# EAGLE design Laptimer (EAGLE 6.3)
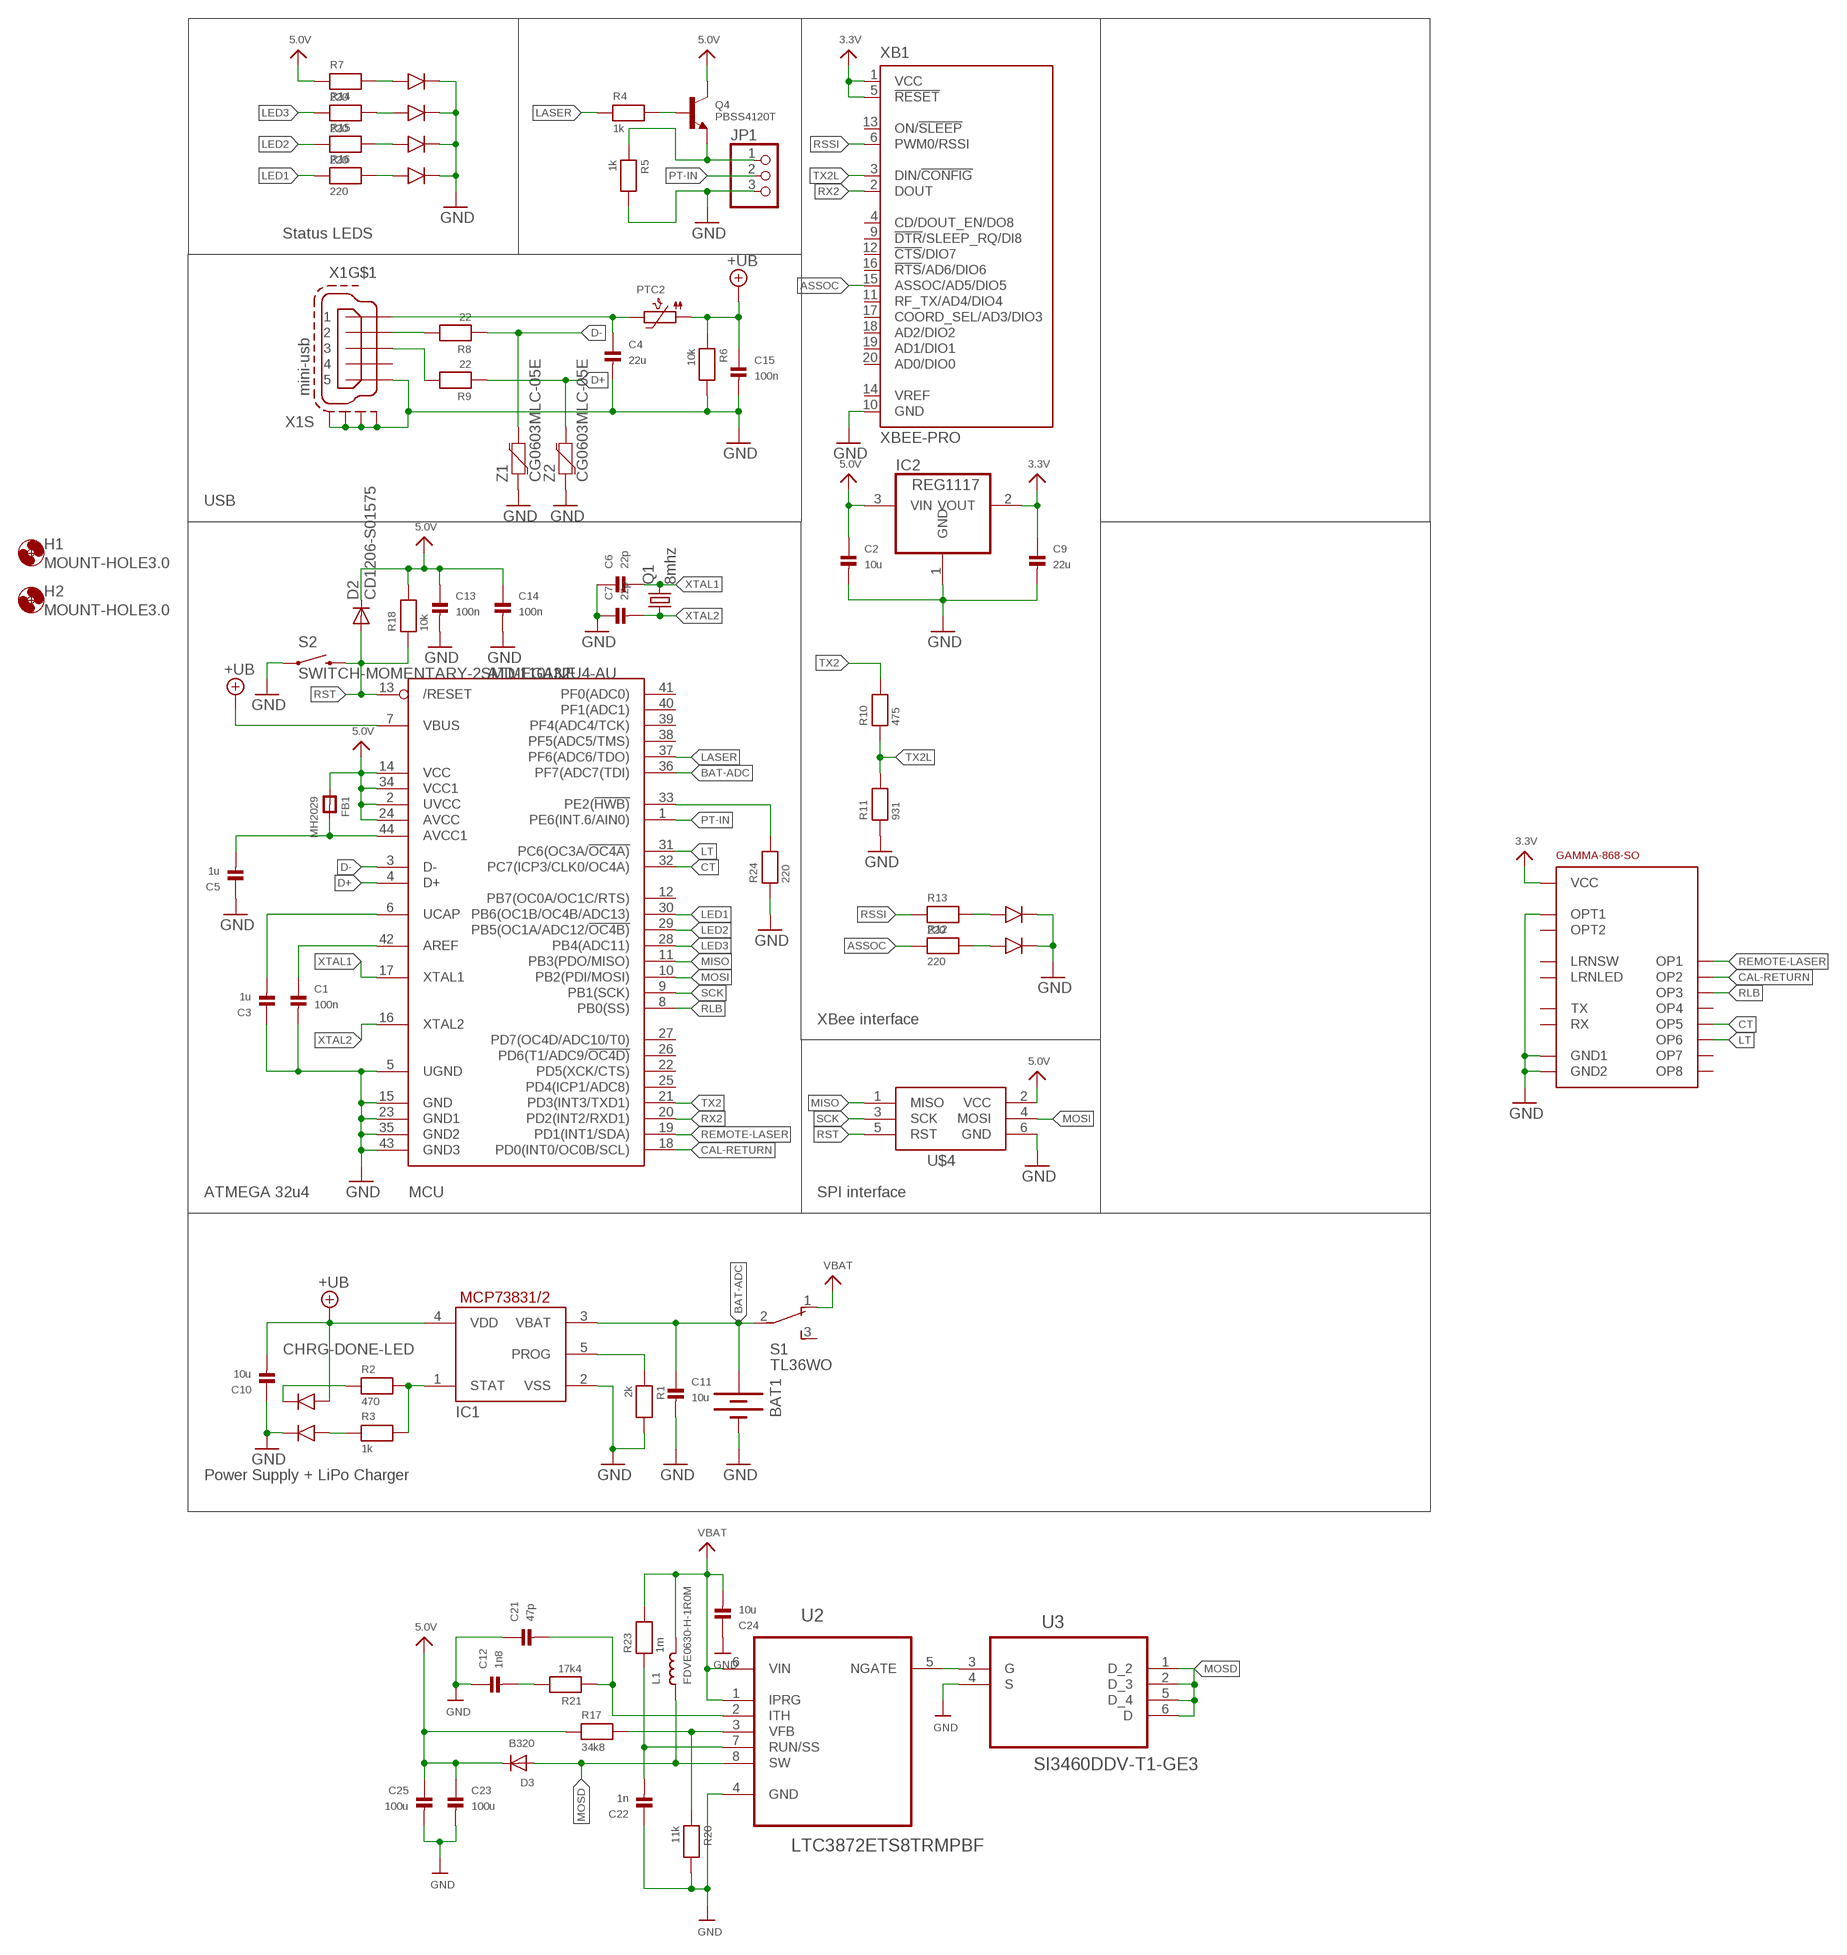
[diagram p0: schematic, sheet 1]

## Parts
BAT1  BATTERY18650  [BATTERY_18650-HOLDER]
C1  100n  CAP_CERAMIC_0603  [_0603]
C2  10u  CAP_CERAMIC_0805  [_0805]
C3  1u  CAP_CERAMIC_0805  [_0805]
C4  22u  CAP_CERAMIC_0805  [_0805]
C5  1u  CAP_CERAMIC_0805  [_0805]
C6  22p  CAP_CERAMIC_0603  [_0603]
C7  22p  CAP_CERAMIC_0603  [_0603]
C9  22u  CAP_CERAMIC_0805  [_0805]
C10  10u  CAP_CERAMIC_0805  [_0805]
C11  10u  CAP_CERAMIC_0805  [_0805]
C12  1n8  CAP_CERAMIC_0603  [_0603]
C13  100n  CAP_CERAMIC_0603  [_0603]
C14  100n  CAP_CERAMIC_0603  [_0603]
C15  100n  CAP_CERAMIC_0603  [_0603]
C21  47p  CAP_CERAMIC_0603  [_0603]
C22  1n  CAP_CERAMIC_0603  [_0603]
C23  100u  CAP_CERAMIC1206  [1206]
C24  10u  CAP_CERAMIC_0805  [_0805]
C25  100u  CAP_CERAMIC1206  [1206]
D2  CD1206-S01575  DIODE-MINIMELF  [MINIMELF]
D3  B320  DIODESMA  [SMADIODE]
FB1  MH2029  FERRITE_0805  [_0805]
H1  MOUNT-HOLE3.0  [3,0]
H2  MOUNT-HOLE3.0  [3,0]
IC1  MCP73831/OT  [SOT23-5L]
IC2  REG1117  [SOT223]
JP1  PINHD-1X3  [1X03]
L1  FDVE0630-H-1R0M  INDUCTORTDK_SLF6045  [INDUCTOR_6X6MM_TDK_SLF6045]
MCU  ATMEGA32U4-AU  [TQFP44]
PTC2  PTC1206  [1206]
Q1  8mhz  CRYSTALHC49S  [HC49/S]
Q4  PBSS4120T  TRANSISTOR_NPNWIDE  [SOT23-WIDE]
R1  2k  RESISTOR_0603  [_0603]
R2  470  RESISTOR_0603  [_0603]
R3  1k  RESISTOR_0603  [_0603]
R4  1k  RESISTOR_0603  [_0603]
R5  1k  RESISTOR_0603  [_0603]
R6  10k  RESISTOR_0603  [_0603]
R7  220  RESISTOR_0603  [_0603]
R8  22  RESISTOR_0603  [_0603]
R9  22  RESISTOR_0603  [_0603]
R10  475  RESISTOR_0603  [_0603]
R11  931  RESISTOR_0603  [_0603]
R12  220  RESISTOR_0603  [_0603]
R13  220  RESISTOR_0603  [_0603]
R14  220  RESISTOR_0603  [_0603]
R15  220  RESISTOR_0603  [_0603]
R16  220  RESISTOR_0603  [_0603]
R17  34k8  RESISTOR_0603  [_0603]
R18  10k  RESISTOR_0603  [_0603]
R20  11k  RESISTOR_0603  [_0603]
R21  17k4  RESISTOR_0603  [_0603]
R23  1m  RESISTOR_0603  [_0603]
R24  220  RESISTOR_0603  [_0603]
S1  TL36WO  [TL3XWO]
S2  SWITCH-MOMENTARY-2SMD-1101NE  [TACTILE-SWITCH-1101NE]
U2  LTC3872ETS8TRMPBF  [SOT65P280X100-8N]
U3  SI3460DDV-T1-GE3  SI3457CDV-T1-GE3  [SOT95P285X110-6N]
U$4  AVRISP-BOX  [AVRISP-BOX]
U$7  GAMMA-868-SO  [UNICORN_V2_GAMMA-868-SO]
U$11  BI-LEVEL-LED-INDICATOR  [BI-LEVEL-LED-INDICATOR]
U$13  BI-LEVEL-LED-INDICATOR  [BI-LEVEL-LED-INDICATOR]
U$14  BI-LEVEL-LED-INDICATOR  [BI-LEVEL-LED-INDICATOR]
U$17  BI-LEVEL-LED-INDICATOR  [BI-LEVEL-LED-INDICATOR]
X1  mini-usb  MINI-USB-SCHIELD-32005-301  [32005-301]
XB1  XBEE-PRO  [XBEE-PRO]
Z1  CG0603MLC-05E  VARISTOR-0603  [0603-RES]
Z2  CG0603MLC-05E  VARISTOR-0603  [0603-RES]

## Nets
1D+: R9.2 X1.3
1D-: R8.2 X1.2
3.3V: C9.1 IC2.2(VOUT) U$7.P$16(VCC) XB1.1(VCC) XB1.5(!RESET)
5.0V: C2.1 C13.1 C14.1 C23.1 C25.1 D2.C D3.C FB1.1 IC2.3(VIN) MCU.2(UVCC) MCU.14(VCC) MCU.24(AVCC) MCU.34(VCC1) Q4.3(C) R7.1 R17.1 R18.2 U$4.2(VCC)
+UB: C10.2 C15.1 IC1.4(VDD) MCU.7(VBUS) PTC2.1 R6.1 U$13.ANODE1
ASSOC: R12.1 XB1.15(ASSOC/AD5/DIO5)
BAT-ADC: BAT1.PWR@1(+) C11.1 IC1.3(VBAT) MCU.36(PF7(ADC7(TDI)) S1.2(P)
CAL-RETURN: MCU.18(PD0(INT0/OC0B/SCL)) U$7.P$4(OP2)
CHRG-DONE-LED: R3.1 U$13.ANODE2
CT: MCU.32(PC7(ICP3/CLK0/OC4A)) U$7.P$9(OP5)
D+: MCU.4(D+) R9.1 Z2.2
D-: MCU.3(D-) R8.1 Z1.2
GND: BAT1.GND@1(-) C1.2 C2.2 C3.1 C4.2 C5.1 C6.1 C7.1 C9.2 C10.1 C11.2 C12.1 C13.2 C14.2 C15.2 C21.1 C22.1 C23.2 C24.1 C25.2 IC1.2(VSS) IC2.1(GND) JP1.3 MCU.5(UGND) MCU.15(GND) MCU.23(GND1) MCU.35(GND2) MCU.43(GND3) R1.2 R5.2 R6.2 R11.1 R20.2 R24.1 S2.1 U2.4(GND) U3.4(S) U$4.6(GND) U$7.P$2(GND1) U$7.P$10(OPT1) U$7.P$15(GND2) U$11.CATHODE1 U$11.CATHODE2 U$13.CATHODE2 U$14.CATHODE1 U$14.CATHODE2 U$17.CATHODE1 U$17.CATHODE2 X1.5 X1.M1(S:S1) X1.M2(S:S2) X1.M3(S:S3) X1.M4(S:S4) XB1.10(GND) Z1.1 Z2.1
LASER: MCU.37(PF6(ADC6/TDO)) R4.1
LED1: MCU.30(PB6(OC1B/OC4B/ADC13)) R16.1
LED2: MCU.29(PB5(OC1A/ADC12/!OC4B)) R15.1
LED3: MCU.28(PB4(ADC11)) R14.1
LT: MCU.31(PC6(OC3A/!OC4A)) U$7.P$11(OP6)
MISO: MCU.11(PB3(PDO/MISO)) U$4.1(MISO)
MOSD: D3.A L1.P$1 U2.8(SW) U3.1(D_2) U3.2(D_3) U3.5(D_4) U3.6(D)
MOSI: MCU.10(PB2(PDI/MOSI)) U$4.4(MOSI)
N$1: R17.2 R20.1 U2.3(VFB)
N$2: C12.2 R21.2
N$3: IC1.5(PROG) R1.1
N$4: IC1.1(STAT) R2.2 R3.2
N$5: JP1.1 Q4.2(E) R5.1
N$6: Q4.1(B) R4.2
N$7: C5.2 FB1.2 MCU.44(AVCC1)
N$8: U2.5(NGATE) U3.3(G)
N$9: C1.1 MCU.42(AREF)
N$10: MCU.33(PE2(!HWB)) R24.2
N$12: C3.2 MCU.6(UCAP)
N$13: C4.1 PTC2.2 X1.1
N$14: R2.1 U$13.CATHODE1
N$15: R16.2 U$17.ANODE1
N$17: R12.2 U$11.ANODE1
N$19: R13.2 U$11.ANODE2
N$21: R15.2 U$17.ANODE2
N$25: R14.2 U$14.ANODE1
N$27: C21.2 R21.1 U2.2(ITH)
N$29: C22.2 R23.1 U2.7(RUN/SS)
N$32: R7.2 U$14.ANODE2
PT-IN: JP1.2 MCU.1(PE6(INT.6/AIN0))
REMOTE-LASER: MCU.19(PD1(INT1/SDA)) U$7.P$3(OP1)
RLB: MCU.8(PB0(SS)) U$7.P$7(OP3)
RSSI: R13.1 XB1.6(PWM0/RSSI)
RST: D2.A MCU.13(/RESET) R18.1 S2.2 U$4.5(RST)
RX2: MCU.20(PD2(INT2/RXD1)) XB1.2(DOUT)
SCK: MCU.9(PB1(SCK)) U$4.3(SCK)
TX2: MCU.21(PD3(INT3/TXD1)) R10.2
TX2L: R10.1 R11.2 XB1.3(DIN/!CONFIG)
VBAT: C24.2 L1.P$2 R23.2 S1.1(O) U2.1(IPRG) U2.6(VIN)
XTAL1: C6.2 MCU.17(XTAL1) Q1.2
XTAL2: C7.2 MCU.16(XTAL2) Q1.1
Unconnected: MCU.12(PB7(OC0A/OC1C/RTS)) MCU.22(PD5(XCK/CTS)) MCU.25(PD4(ICP1/ADC8)) MCU.26(PD6(T1/ADC9/!OC4D)) MCU.27(PD7(OC4D/ADC10/T0)) MCU.38(PF5(ADC5/TMS)) MCU.39(PF4(ADC4/TCK)) MCU.40(PF1(ADC1)) MCU.41(PF0(ADC0)) S1.3(S) U$7.P$5(LRNSW) U$7.P$6(LRNLED) U$7.P$8(OP4) U$7.P$12(OP7) U$7.P$13(OP8) U$7.P$14(OPT2) U$7.P$17(TX) U$7.P$18(RX) X1.4 XB1.4(CD/DOUT_EN/DO8) XB1.9(!DTR!/SLEEP_RQ/DI8) XB1.11(RF_TX/AD4/DIO4) XB1.12(!CTS!/DIO7) XB1.13(ON/!SLEEP) XB1.14(VREF) XB1.16(!RTS!/AD6/DIO6) XB1.17(COORD_SEL/AD3/DIO3) XB1.18(AD2/DIO2) XB1.19(AD1/DIO1) XB1.20(AD0/DIO0)

## Notes on the sheet
- Status LEDS
- USB
- XBee interface
- ATMEGA 32u4 | SPI interface
- Power Supply + LiPo Charger

## Library data of the parts
BAT1 = SparkFun-Electromechanical:BATTERY: Battery Holders Various common sizes : AA, AAA, 18650 (PRT-12895), 20mm coin cell and 12mm coin cell. 20MM_4LEGS, BATT-10373
C1-C7 C9-C15 C21-C25 = microbuilder:CAP_CERAMIC: Ceramic Capacitors 0402 - 0402 Surface Mount Capacitors 16pF 50V 5% [Digikey: 445-4899-2-ND] 18pF 50V 5% [Digikey: 490-1281-2-ND] 22pF 50V 5% [Digikey: 490-1283-2-ND] 68pF 50V 5% [Digikey: 490-1289-2-ND] 0.1uF 10V 10% [Digikey: 490-1318-2-ND] 1.0uF 6.3V 10% [Digikey: 490-1320-2-ND] 0603 - 0603 Surface Mount Capacitors 16 pF 50V 5% [Digikey: 445-5051-2-ND] 22 pF 50V [Digikey: PCC220ACVTR-ND] 33 pF 50V 5% [Digikey: 490-1415-1-ND] 56pF 50V 5% [Digikey: 490-1421-1-ND] 220pF 50V 5% [Digikey: 445-1285-1-ND] 680 pF 50V 2200 pF 50V 5% C0G [Digikey: 445-1297-1-ND] 5600 pF 100V 5% X7R [Digikey: 478-3711-1-ND] 0.1 µF 25V 10% [Digikey: PCC2277TR-ND] 0.22 µF 16V 10% X7R [Digikey: 445-1318-1-ND] 1.0 µF 25V 10% [Digikey: 445-5146-2-ND] 0603 - RF Specific 3pF 250V +/-0.1pF RF [Digikey: 712-1347-1-ND] 18 pF 250V 5% [Digikey: 478-3505-1-ND or 712-1322-1-ND] 56 pF 250V 5% C0G RF [Digikey: 490-4867-1-ND] 68 pF 250V RF [Digikey: 490-4868-1-ND] 0805 - 0805 Surface Mount Capacitors 220 pF 250V 2% RF Ceramic Capacitor [Digikey: 712-1398-1-ND] 1000 pF 50V 2% NP0 Ceramic Capacitor [Digikey: 478-3760-1-ND] 0.1 µF 25V 10% Ceramic Capacitor [Digikey: PCC1828TR-ND] 1.0 µF 16V 10% Ceramic Capacitor[Digikey: 490-1691-2-ND] 10.0 µF 10V 10% Ceramic Capacitor[Digikey: 709-1228-1-ND] 10.0 uF 16V 10% Ceramic Capacitor [Digikey: 478-5165-2-ND] 47 uF 6.3V 20% Ceramic Capacitor [Digikey: 587-1779-1-ND or 399-5506-1-ND] 1206 - 1206 Surface Mount Capacitors 47uF 10V 20% Ceramic Capacitor [Digikey: 490-5528-1-ND or 399-5508-1-ND or 445-6010-1-ND] 100uF 6.3V -20%, +80% Y5V Ceramic Capacitor (Digikey: 490-4512-1-ND, Mouser: 81-GRM31CF50J107ZE1L)
D2 = diode:DIODE-: DIODE
D3 = adafruit:DIODE: Diode SMADIODE - SMA Surface Mount Package 20V 1A Schottky Diode Digikey: 641-1014-6-ND DO-1N4148 - Through Hole Small Current Diode SOD-123 20V 1 A (.5mV Vf) Schottky Diode - Digikey: MBRX120TPMSCT-ND SOD-323 10V 570mA (.38mV Vf, 3ns) Schottky Diode - Digikey: ZLLS410CT-ND SOD-523 30V 30mA Schottky Diode (RB751S-40TE61) - Digikey: RB751S-40TE61CT-ND SOT23-R/W - SOT23 Package (R = Solder Paste/Reflow Ovens, W = Hand-Soldering) BAT54Film 40V 300mA - Digikey: 497-7162-1-ND
FB1 = microbuilder:FERRITE: Ferrite Bead 0603 MMZ1608B121C - 120 Ohm @ 100MHz, 600mA, 0.15 Ohm DC Resistance - Digikey: 445-2164-1-ND BK1608HW121-T - 120 Ohm, 600mA Ferrite Chip - Digikey: 587-1876-2-ND 0805 HZ0805B272R-10 - 2.7K Ohm @ 100MHz, 200mA, 0.8 Ohm DC Resistance - Digikey: 240-2504-1-ND (see also Murata BLM21BD272SN1L) MMZ2012Y152B - 1.5K Ohm @ 100MHz, 500mA, 0.4 Ohm DC Resistance - Digikey: 445-1560-1-ND - Mainly for high frequency (80-400MHz) MMZ2012R102A - 1K Ohm @ 100MHz, 500mA, 0.3 Ohm DC Resistance - Digikey: 445-1555-2-ND - More general purpose (10-200MHz)
H1 H2 = holes:MOUNT-HOLE: MOUNTING HOLE with drill center marker
IC1 = adafruit:MCP73831: MCP73831/2 Miniature Single-Cell, Fully Integrated Li-Ion, Li-Polymer Charge Management Controllers. Nice and small simple lipoly charge controller, with adjustable current and status output (LED) http://www.ladyada.net/library/pcb/eaglelibrary.html
IC2 = burr-brown:REG1117: 800mA and 1A Low Dropout (LDO) Positive Regulator 1.8V, 2.5V, 2.85V, 3.3V, 5V, and Adj; MPN: REG1117; OC_FARNELL: 1097566; OC_NEWARK: 14P6981
JP1 = adafruit:PINHD-1X3: PIN HEADER
L1 = microbuilder:INDUCTOR: Inductors 0603: 10nH Ceramic Inductor - microwire antenna/RF (Digikey: 712-1434-2-ND) 0805: 560nH Ceramic Inductor - RF (Digikey: 553-1047-1-ND) 270nH Ceramic Inductor - Q = 40@250MHz, +-5%, 1 Ohm DC Resistance (Digikey: 535-10506-2-ND) 1007 (2518 Metric) SMT: 10µH 10% 250mOhm 820mA 1007 Inductor (Digikey: 587-2189-1-ND) 22µH 10% 500mOhm 580mA 1007 Inductor (Digikey: 587-2190-1-ND) 47µH 10% 950mOhm 420mA 1007 Inductor (Digikey: 587-2191-1-ND) 47µH 5% 100mOhm 1A 1008 Inductor (Digikey: 732-1816-1-ND) 5.0x5.0mm (Taiyo Yuden NR5040 Series) 6.8µH 20% 2.3A 64mOhm Inductor (Digikey: 587-2374-2-ND) 5.0x5.0mm (TDK VLC5045 Series) 4.7µH 20% 3.3A 34mOhm Inductor (Digikey: 445-6526-1-ND) 6.8µH 20% 2.7A 46mOhm Inductor (Digikey: 445-6527-1-ND) 6.0x6.0mm (TDK VLC6045 Series) 4.7µH 20% 3.8A 27mOhm Inductor (Digikey: 445-6538-2-ND) 6.8µH 20% 3A 41mOhm Inductor (Digikey: 445-6540-1-ND) 6.2µH 30% 2.2A 45mOhm Inductor (Digikey: SRR5028-6R2YCT-ND) - Not TDK VLC6045 but footprint should match 6.0x6.0mm (TDK SLF6045 Series) 6.8uH 30% 2A 33mOhm Inductor (Digikey: 445-4572-1-ND, Mouser: 810-SLF645T6R8N2R0PF)
MCU = adafruit:ATMEGA32U4: http://www.ladyada.net/library/eagle
PTC2 = microbuilder:PTC: PTC (Resettable Fuse) 1206 Package 250mA PTC (16V Max, Time-to-Trip: 0.08s) - Digikey: F2110CT-ND 1210 Package 100mA PTC (30V Max, Time-to-Trip: 0.6s) - Digikey: MF-USMF010-2CT-ND 1812 Package 750mA PTC (24V Max, Time-to-Trip: 0.2s) - Digikey: MF-MSMF075/24-2CT-ND
Q1 = adafruit:CRYSTAL: CRYSTAL; OC_FARNELL: 1667008; OC_NEWARK: unknown
Q4 = microbuilder:TRANSISTOR_NPN: NPN Transistor Transistor (NPN) 500mA 45V - BC817 [Digikey: 568-1631-1-ND] Transistor (NPN) 500mA 45V - BC817,215 [Mouser: 771-BC817-T/R] SOT23-R - SOT23 footprint optimised for use with solder paste and reflow ovens. SOT23-W - SOT23 footprint optimised for hand-soldering (larger pads).
R1-R18 R20 R21 R23 R24 = microbuilder:RESISTOR: Resistors 0402 - 0402 Surface Mount Package 22 Ohm 1% 1/16W [Digikey: 311-22.0LRTR-ND] 33 Ohm 5% 1/16W 1.0K 5% 1/16W 1.5K 5% 1/16W 2.0K 1% 1/16W 10.0K 1% 1/16W [Digikey: 311-10.0KLRTR-ND] 10.0K 5% 1/16W [Digikey: RMCF0402JT10K0TR-ND] 12.1K 1% 1/16W [Digikey: 311-22.0LRTR-ND] 100.0K 5% 1/16W 0603 - 0603 Surface Mount Package 0 Ohm 1/10 Watt 1% Resistor 15 Ohm 1/10 Watt 1% Resistor 33 Ohm 1/10 Watt 1% Resistor 49.9 Ohm 1/10 Watt 1% Resistor 100 Ohm 1/10 Watt 1% Resistor 150 Ohm 1/10 Watt 1% Resistor 240 Ohm 1/10 Watt 1% Resistor 390 Ohm 1/10 Watt 1% Resistor 560 Ohm 1/10 Watt 1% Resistor 680 Ohm 1/10 Watt 1% Resistor 750 Ohm 1/10 Watt 1% Resistor 1.0K Ohm 1/10 Watt 1% Resistor 1.5K Ohm 1/10 Watt 1% Resistor 2.0K Ohm 1/10 Watt 1% Resistor 2.2K Ohm 1/10 Watt 1% Resistor 3.3K Ohm 1/10 Watt 1% Resistor 4.7K Ohm 1/10 Watt 1% Resistor 10.0K Ohm 1/10 Watt 1% Resistor 12.0K Ohm 1/10 Watt 1% Resistor 12.1K Ohm 1/10 Watt 1% Resistor 20.0K Ohm 1/10 Watt 1% Resistor 33.0K Ohm 1/10 Watt 1% Resistor 100.0K Ohm 1/10 Watt 1% Resistor 0805 - 0805 Surface Mount Package 0 Ohm 1/8 Watt 1% Resistor 33 Ohm 1/8 Watt 1% Resistor 100 Ohm 1/8 Watt 1% Resistor 150 Ohm 1/8 Watt 1% Resistor 200 Ohm 1/8 Watt 1% Resistor 240 Ohm 1/8 Watt 1% Resistor 330 Ohm 1/8 Watt 1% Resistor 390 Ohm 1/8 Watt 1% Resistor 470 Ohm 1/8 Watt 1% Resistor 1.0K Ohm 1/8 Watt 1% Resistor 1.5K Ohm 1/8 Watt 1% Resistor 2.0K Ohm 1/8 Watt 1% Resistor 4.7K Ohm 1/8 Watt 1% Resistor 5.1K Ohm 1/8 Watt 1% Resistor 5.6K Ohm 1/8 Watt 1% Resistor 10.0K Ohm 1/8 Watt 1% Resistor 22.0K Ohm 1/8 Watt 1% Resistor 33.0K Ohm 1/8 Watt 1% Resistor 100K Ohm 1/8 Watt 1% Resistor 1206 - 1206 Surface Mount Package 2012 - 2010 Surface Mount Package 0.11 Ohm 1/2 Watt 1% Resistor - Digikey: RHM.11UCT-ND
S1 = switch:TL36WO: TINY SWITCH ON - ON Source: http://www2.produktinfo.conrad.com/datenblaetter/700000-724999/705152-da-01-de-Subminiaturschalter_TL_36WO.pdf
S2 = SparkFun-Electromechanical:SWITCH-MOMENTARY-2: Various NO switches- pushbuttons, reed, etc; PROD_ID: SWCH-00815
U2 = LTC_By_element14_Batch_1:LTC3872ETS8TRMPBF: DC/DC Controller; MPN: LTC3872ETS8#TRMPBF; OC_FARNELL: 1556409; OC_NEWARK: 56M8617; PACKAGE: SOT-23-8; SUPPLIER: LINEAR TECHNOLOGY
U3 = Vishay_By_element14_Batch_1:SI3457CDV-T1-GE3: N-Channel 30-V (D-S) MOSFET; MPN: SI3457CDV-T1-GE3; OC_FARNELL: 1840420; OC_NEWARK: 90R9127; PACKAGE: TSOP-6; SUPPLIER: Vishay Siliconix
U$4 = adafruit:AVRISP: AVR ISP HEADER Standard 6 pin header for AVR programming
U$7 = unicorn_v2:GAMMA-868-SO
U$11 U$13 U$14 U$17 = unicorn_v2:BI-LEVEL-LED-INDICATOR
X1 = con-cypressindustries:MINI-USB-SCHIELD-: MINI USB-B Conector Source: www.cypressindustries.com; OC_FARNELL: unknown; OC_NEWARK: unknown
XB1 = microbuilder:XBEE: XBee (TM) /XBee-PRO(TM) OEM RF Modules Source: MaxStream, Inc. xbee_productmanual.pdf
Z1 Z2 = SparkFun-DiscreteSemi:VARISTOR: Varistor Varistor (Variable resistor) is a nonlinear resistive element of the voltage dependence that resistance changes with applied voltage. Varistor is equivalent with Zener diode of two series connection.

## Board
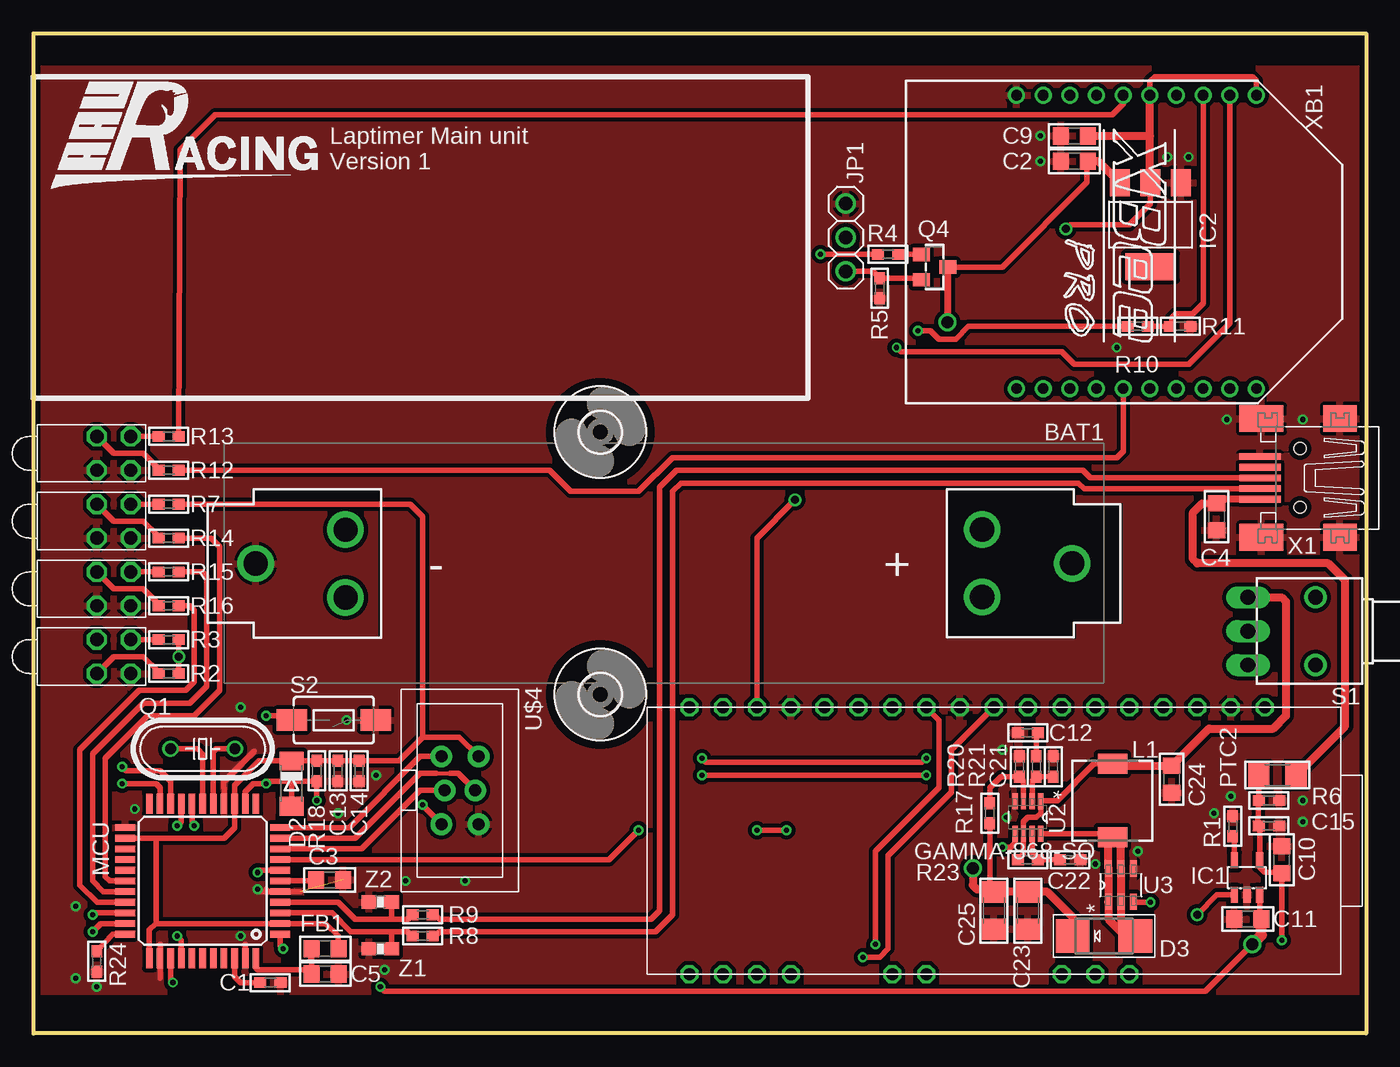
[diagram p1: board, top side]
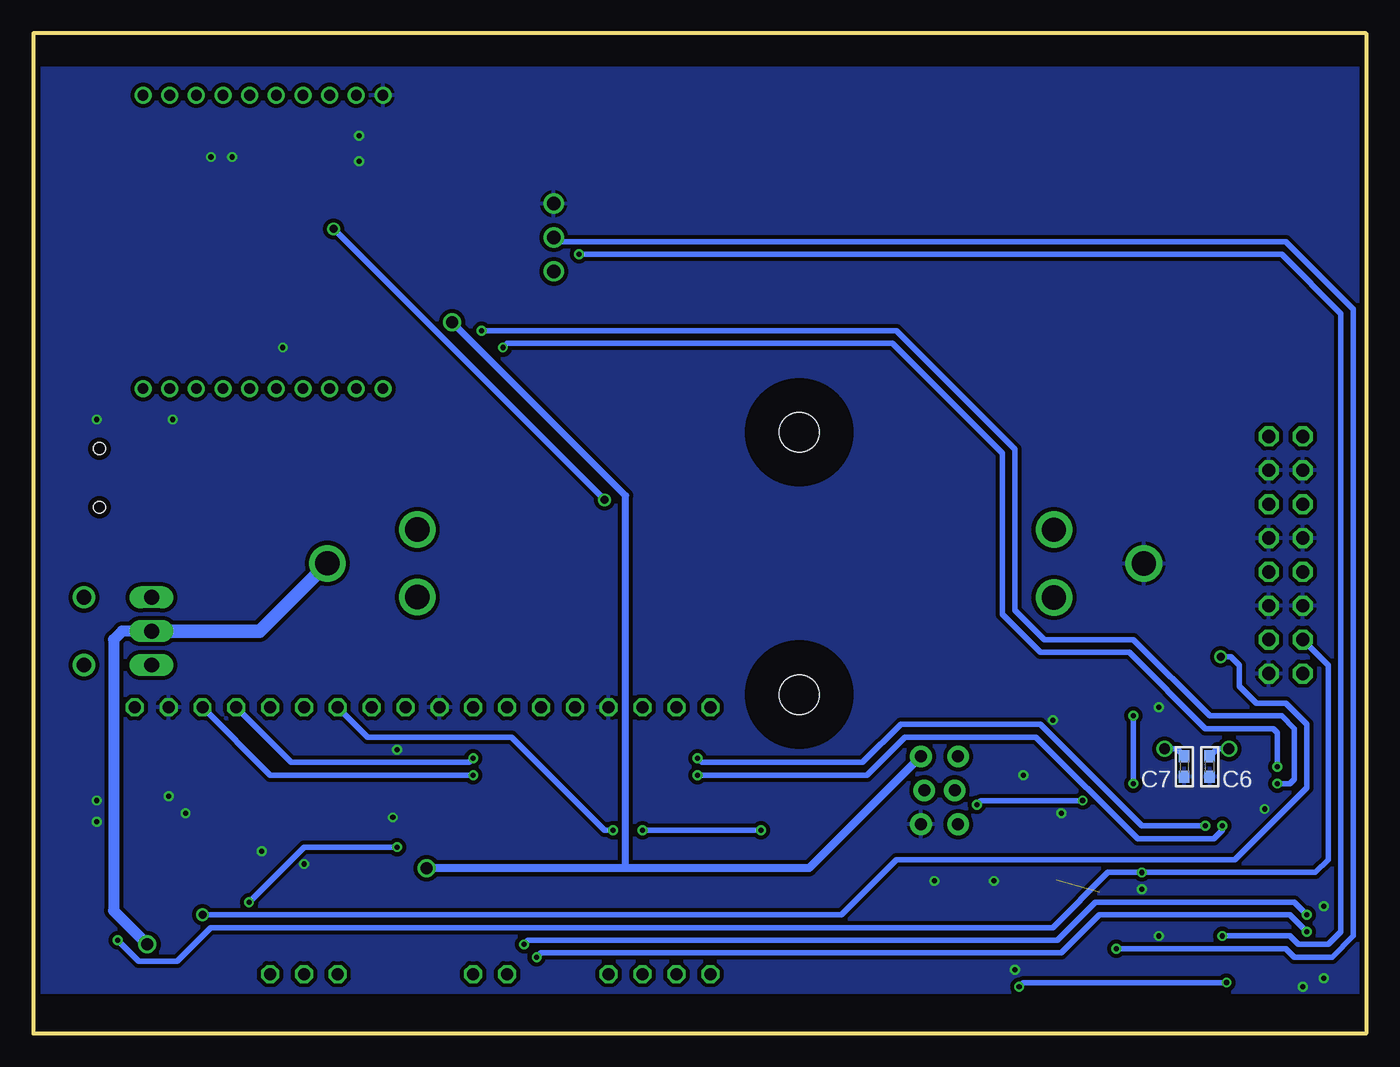
[diagram p2: board, bottom side, seen from below]

Size 100 x 75 mm. Coordinates in mm from the lower left corner, seen from the top.
Outline: 0,75 100,75 100,0 0,0 0,75
Copper layers (1*16): Top 0.0356mm / dielectric 1.5011mm / Bottom 0.0356mm
Design rules "LaenPCBOrder *": minimum track width 6mil, minimum drill 13mil, track to track 12mil, track to pad 12mil, pad to pad 12mil, via to via 12mil, smd to smd 12mil, copper to edge 15mil, drill to drill 6mil, minimum pad ring 7mil, minimum via ring 7mil, stop-mask expansion 3mil, vias tented up to drill 0mil, thermal gap 10mil

### Footprints (pad centres in the part's own frame; a part is rotated, then mirrored left to right if it is on the bottom)
BATTERY_18650-HOLDER = drill 1.829: GND@1 30.628,0.01; GND@2 23.88,2.55; GND@3 23.88,-2.53; PWR@1 -30.628,-0.01; PWR@2 -23.88,2.53; PWR@3 -23.88,-2.55
_0603 = smd 0.9 x 0.8: 1 -0.762,0; 2 0.762,0
_0805 = smd 1.2 x 1.3: 1 -1.016,0; 2 1.016,0
1206 = smd 1.6 x 1.8: 1 -1.4,0; 2 1.4,0
MINIMELF = smd 1.4 x 1.8: A 1.7,0; C -1.7,0
SMADIODE = smd 2.54 x 2.54: A 2.349,0; C -2.349,0
3,0 = hole 3: 0,0
SOT23-5L = smd 0.55 x 1.2: 1 -0.95,-1.3; 2 0,-1.3; 3 0.95,-1.3; 4 0.95,1.3; 5 -0.95,1.3
SOT223 = smd 1.499 x 2.007: 1 -2.261,-3.15; 2 0.025,-3.15; 3 2.311,-3.15 | smd 3.81 x 2.007: 4 0,3.15
1X03 = drill 1.016: 1 -2.54,0; 2 0,0; 3 2.54,0
INDUCTOR_6X6MM_TDK_SLF6045 = smd 1.5 x 2.2: P$1 -2.75,0; P$2 2.75,0
TQFP44 = smd 1.5 x 0.5: 1 -5.8,4; 2 -5.8,3.2; 3 -5.8,2.4; 4 -5.8,1.6; 5 -5.8,0.8; 6 -5.8,0; 7 -5.8,-0.8; 8 -5.8,-1.6; 9 -5.8,-2.4; 10 -5.8,-3.2; 11 -5.8,-4; 23 5.8,-4; 24 5.8,-3.2; 25 5.8,-2.4; 26 5.8,-1.6; 27 5.8,-0.8; 28 5.8,0; 29 5.8,0.8; 30 5.8,1.6; 31 5.8,2.4; 32 5.8,3.2; 33 5.8,4 | smd 0.5 x 1.5: 12 -4,-5.8; 13 -3.2,-5.8; 14 -2.4,-5.8; 15 -1.6,-5.8; 16 -0.8,-5.8; 17 0,-5.8; 18 0.8,-5.8; 19 1.6,-5.8; 20 2.4,-5.8; 21 3.2,-5.8; 22 4,-5.8; 34 4,5.8; 35 3.2,5.8; 36 2.4,5.8; 37 1.6,5.8; 38 0.8,5.8; 39 0,5.8; 40 -0.8,5.8; 41 -1.6,5.8; 42 -2.4,5.8; 43 -3.2,5.8; 44 -4,5.8
HC49/S = drill 0.813: 1 -2.413,0; 2 2.413,0
SOT23-WIDE = smd 1 x 1.27: 1 -0.95,-1; 2 0.95,-1; 3 0,1
TL3XWO = drill 1.1 pad 1.422 long: 1 -2.54,-5.08; 2 0,-5.08; 3 2.54,-5.08 | drill 1.1 pad 1.676: M1 -2.54,0; M2 2.54,0
TACTILE-SWITCH-1101NE = smd 2.3 x 1.6: 1 -3.15,0; 2 3.15,0
SOT65P280X100-8N = smd 1.219 x 0.406: 1 -1.219,0.965; 2 -1.219,0.33; 3 -1.219,-0.33; 4 -1.219,-0.965; 5 1.219,-0.965; 6 1.219,-0.33; 7 1.219,0.33; 8 1.219,0.965
SOT95P285X110-6N = smd 1.219 x 0.508: 1 -1.245,0.94; 2 -1.245,0; 3 -1.245,-0.94; 4 1.245,-0.94; 5 1.245,0; 6 1.245,0.94
AVRISP-BOX = drill 0.9 pad 1.626: 1 -1.397,2.54; 2 1.397,2.54; 3 -1.143,0; 4 1.143,0; 5 -1.397,-2.54; 6 1.397,-2.54
UNICORN_V2_GAMMA-868-SO = drill 0.9 octagon: P$1 0,0; P$2 2.54,0; P$3 5.08,0; P$4 7.62,0; P$5 10.16,0; P$6 12.7,0; P$7 15.24,0; P$8 17.78,0; P$9 20.32,0; P$10 22.86,0; P$11 25.4,0; P$12 27.94,0; P$13 30.48,0; P$14 33.02,0; P$15 35.56,0; P$16 38.1,0; P$17 40.64,0; P$18 43.18,0; P$19 43.18,20.003; P$20 40.64,20.003; P$21 38.1,20.003; P$22 35.56,20.003; P$23 27.94,20.003; P$24 25.4,20.003; P$25 15.24,20.003; P$26 12.7,20.003; P$27 10.16,20.003
BI-LEVEL-LED-INDICATOR = drill 1 octagon: ANODE1 1.27,1.27; ANODE2 1.27,-1.27; CATHODE1 -1.27,1.27; CATHODE2 -1.27,-1.27
32005-301 = smd 3.1 x 0.5: 1 3,1.6; 2 3,0.8; 3 3,0; 4 3,-0.8; 5 3,-1.6 | smd 2.5 x 2: M1 -3,-4.45; M2 -3,4.45 | smd 3.3 x 2: M3 2.9,4.45; M4 2.9,-4.45 | hole 0.9: 0,2.2; 0,-2.2
XBEE-PRO = drill 0.8 pad 1.27: 1 -11,9; 2 -11,7; 3 -11,5; 4 -11,3; 5 -11,1; 6 -11,-1; 7 -11,-3; 8 -11,-5; 9 -11,-7; 10 -11,-9; 11 11,-9; 12 11,-7; 13 11,-5; 14 11,-3; 15 11,-1; 16 11,1; 17 11,3; 18 11,5; 19 11,7; 20 11,9
0603-RES = smd 1.1 x 1: 1 -0.85,0; 2 0.85,0

### Placement (x,y rotation side)
BAT1  47.31,35.24 180 top
C1  17.78,3.81 0 top
C2  78.11,65.41 180 top
C3  22.23,11.51 180 top
C4  88.77,38.73 270 top
C5  21.91,4.45 180 top
C6  11.75,20 90 bottom
C7  13.65,20 90 bottom
C9  78.11,67.31 180 top
C10  93.66,13.02 270 top
C11  91.12,8.57 180 top
C12  74.61,22.54 0 top
C13  22.86,19.68 270 top
C14  24.45,19.68 270 top
C15  92.71,15.56 0 top
C21  76.52,20 270 top
C22  77.79,13.02 180 top
C23  74.61,9.21 270 top
C24  85.41,19.05 90 top
C25  72.07,9.21 270 top
D2  19.37,18.73 270 top
D3  80.33,7.3 0 top
FB1  21.91,6.35 180 top
H1  42.55,45.09 0 top
H2  42.55,25.4 0 top
IC1  91.06,11.68 0 top
IC2  83.82,60.64 180 top
JP1  60.96,59.69 90 top
L1  80.96,17.46 90 top
MCU  12.71,11.43 180 top
PTC2  93.34,19.37 0 top
Q1  12.71,21.34 180 top
Q4  67.63,57.47 270 top
R1  89.99,15.53 90 top
R2  10.16,26.99 0 top
R3  10.16,29.53 0 top
R4  64.14,58.42 0 top
R5  63.5,55.88 270 top
R6  92.71,17.46 0 top
R7  10.16,39.69 180 top
R8  29.21,7.3 0 top
R9  29.21,8.89 0 top
R10  82.87,53.02 180 top
R11  86.04,53.02 180 top
R12  10.16,42.23 180 top
R13  10.16,44.77 180 top
R14  10.16,37.15 180 top
R15  10.16,34.61 180 top
R16  10.16,32.07 180 top
R17  71.75,16.51 90 top
R18  21.27,19.68 90 top
R20  73.98,20 90 top
R21  75.25,20 90 top
R23  74.61,13.02 180 top
R24  4.76,5.4 90 top
S1  96.2,30.16 270 top
S2  22.54,23.5 180 top
U2  74.61,16.19 270 top
U3  81.6,11.11 90 top
U$4  32.01,18.22 0 top
U$7  92.39,24.45 180 top
U$11  6.03,43.5 90 top
U$13  6.03,28.26 90 top
U$14  6.03,38.42 90 top
U$17  6.03,33.34 90 top
X1  95.03,41.66 180 top
XB1  82.77,59.35 270 top
Z1  26.04,6.35 0 top
Z2  26.04,9.84 0 top

### Tracks (layer width: path | path; a pad name or v marks a point on that pad's centre or on a via)
1D+
  Top 0.406: R9.2 30.16,8.89 30.48,8.57 46.35,8.57 46.99,9.21 46.99,40.96 48.26,42.23 78.74,42.23 79.31,41.66 X1.3
1D-
  Top 0.406: R8.2 30.16,7.3 30.48,7.62 46.67,7.62 47.94,8.89 47.94,40.64 48.58,41.27 78.42,41.27 78.84,40.86 X1.2
3.3V  (via drill 0.6)
  Top 0.406: XB1.5 83.77,71.39 84.14,71.75 91.44,71.75 91.76,71.44 91.76,70.37 XB1.1 | 83.82,62.87 84.14,63.18 84.14,63.45 IC2.2 83.8,62.2 82.23,60.64 77.79,60.64 v77.47,60.33 | U$7.P$16 54.29,37.15 v57.15,40.01
  Top 0.61: IC2.2 83.77,63.82 83.77,67.31 | 83.77,67.31 XB1.5 | C9.1 83.77,67.31
  Bottom 0.406: v57.15,40.01 v77.47,60.33
5.0V  (via drill 0.9)
  Top 0.406: 29.21,22.23 27.43,20.45 C14.1 C13.1 R18.2 19.38,20.45 D2.C 16.94,20.43 15.11,18.6 MCU.14 15.11,15.42 14.31,14.63 9.21,14.63 | 29.21,22.23 31.95,22.23 U$4.2 | FB1.1 22.86,6.1 22.86,7.3 21.93,8.23 MCU.2 9.18,8.23 | 9.18,8.23 8.71,7.75 MCU.34 | MCU.24 9.21,14.63 | 9.18,8.23 9.21,8.26 9.21,14.63 | 71.75,10.93 R17.1 | Q4.3 72.71,57.47 79.06,63.82 79.06,65.34 C2.1 | R7.1 28.26,39.69 29.21,38.73 29.21,22.23
  Top 0.508: v68.58,53.34 68.63,53.39 Q4.3
  Top 0.61: IC2.3 79.9,65.41 C2.1 | D3.C 77.98,8.7 76.07,10.61 C23.1 C25.1 | C25.1 71.75,10.93 | v70.48,12.38 70.48,11.11 70.8,10.79 71.89,10.79 C25.1
  Bottom 0.508: 55.56,12.38 55.56,40.32 v68.58,53.34
  Bottom 0.61: U$4.2 41.79,12.38 55.56,12.38 v70.48,12.38
+UB  (via drill 0.38)
  Top 0.406: 92.01,15.24 IC1.4 92.01,12.45 92.39,12.06 93.6,12.06 C10.2 v93.66,6.99 | 92.01,15.24 92.01,15.7 | PTC2.1 91.94,17.55 R6.1 91.86,15.9 91.86,15.65 | MCU.7 16.99,12.23 v16.83,12.06 | 91.86,15.65 C15.1 | 91.86,15.65 91.86,15.39 92.01,15.24
  Bottom 0.406: v93.66,6.99 92.08,5.4 89.22,5.4 86.68,7.94 23.5,7.94 19.37,12.06 v16.83,12.06 3.81,12.06 2.86,13.02 2.86,27.62 U$13.ANODE1
ASSOC
  Top 0.406: R12.1 38.73,42.23 40.32,40.64 45.4,40.64 47.94,43.18 81.28,43.18 81.77,43.67 XB1.15
BAT-ADC  (via drill 0.38, 0.9)
  Top 0.406: IC1.3 92.01,8.7 C11.1 | MCU.36 10.31,3.96 v10.48,3.81 | v26.04,3.49 26.35,3.17 87.95,3.17 v91.44,6.67
  Top 0.813: v91.44,6.67 92.14,7.37 C11.1
  Bottom 0.406: v10.48,3.81 25.72,3.81 v26.04,3.49
  Bottom 0.813: S1.2 93.34,30.16 93.98,29.53 93.98,9.21 v91.44,6.67
  Bottom 1.016: BAT1.PWR@1 83.03,30.16 S1.2
CAL-RETURN  (via drill 0.38)
  Top 0.406: MCU.18 11.91,15.72 v12.06,15.56 | v50.16,20.64 50.48,20.32 66.67,20.32 v66.99,20.64
  Bottom 0.406: v12.06,15.56 16.83,15.56 24.45,23.18 34.92,23.18 37.78,20.32 49.85,20.32 v50.16,20.64 | v66.99,20.64 67.31,20.32 80.64,20.32 U$7.P$4
CHRG-DONE-LED
  Top 0.406: U$13.ANODE2 R3.1
CT  (via drill 0.38)
  Top 0.406: MCU.32 5.05,8.23 v4.45,7.62 | v62.23,5.71 63.5,5.71 64.14,6.35 64.14,13.34 68.9,18.1 68.9,21.27 U$7.P$9
  Bottom 0.406: v4.45,7.62 5.71,8.89 20,8.89 22.86,6.03 61.91,6.03 v62.23,5.71
D+
  Top 0.406: MCU.4 22.87,9.83 24.13,8.57 26.89,8.57 | Z2.2 26.89,8.57 | 26.89,8.57 28.13,8.57 R9.1
D-
  Top 0.406: MCU.3 22.4,9.03 23.81,7.62 26.89,7.62 | Z1.2 26.89,7.62 | 26.89,7.62 28.13,7.62 R8.1
GND  (via drill 0.38)  (1 unrouted)
  Top 0.406: MCU.15 14.31,18.4 14.29,18.41 14.29,18.86 16.57,21.14 | MCU.5 20,10.63 | MCU.43 15.91,6.64 15.88,6.67 | 9.53,6.67 9.51,6.65 MCU.35 9.51,4.15 9.53,4.13 | MCU.5 17.63,10.63 17.46,10.79 | v16.83,10.79 16.99,10.63 MCU.5
  other vias: 15.56,24.45 25.72,19.37 73.03,16.19 72.71,21.27 15.56,7.3 79.69,12.7 82.87,13.65 75.56,65.41 75.56,67.31 85.09,65.72 86.68,65.72 23.5,23.5 7.62,16.83 81.28,51.44 89.53,46.04 95.25,46.04 89.85,17.78 88.58,16.51 95.25,17.46 95.25,15.88 27.94,11.43 32.38,11.43 3.17,4.13 4.76,3.49 26.35,4.76 22.86,16.51 3.17,9.53
  pour Top: 0,72.33 100.14,72.33 100.14,3.12 0.13,3.12
  pour Bottom: 0,72.33 100.14,72.33 100.14,3.12 0.13,3.12
LASER  (via drill 0.38)
  Top 0.406: MCU.37 11.11,6.99 v10.79,7.3 | v59.05,58.42 R4.1
  Bottom 0.406: v10.79,7.3 5.71,7.3 5.08,6.67 2.86,6.67 1.91,7.62 1.91,53.98 6.35,58.42 v59.05,58.42
LED1
  Top 0.406: MCU.30 4.78,9.83 3.49,11.11 3.49,21.27 7.94,25.72 11.43,25.72 12.06,26.35 12.06,31.75 11.75,32.07 R16.1
LED2
  Top 0.406: MCU.29 5.25,10.63 4.45,11.43 4.45,20.95 8.26,24.77 11.75,24.77 13.02,26.04 13.02,34.29 12.7,34.61 R15.1
LED3
  Top 0.406: MCU.28 5.71,11.43 5.4,11.75 5.4,20.64 8.57,23.81 12.06,23.81 13.97,25.72 13.97,36.51 13.34,37.15 R14.1
LT  (via drill 0.38)
  Top 0.406: MCU.31 4.58,9.03 v4.45,8.89 | v63.18,6.67 63.18,13.65 67.94,18.41 67.94,23.5 U$7.P$11
  Bottom 0.406: v4.45,8.89 5.4,9.84 20.32,9.84 23.18,6.99 62.87,6.99 v63.18,6.67
MISO
  Top 0.406: MCU.11 23.68,15.43 29.02,20.77 U$4.1
MOSD
  Top 0.406: U2.8 80.7,14.97 L1.P$1
  Top 0.61: U3.1 80.66,8.56 81.6,7.62 82.36,7.62 D3.A 81.6,8.38 U3.2 U3.5 81.6,14.08 L1.P$1 80.66,14.41 U3.6 80.66,9.86 80.64,9.84
MOSI
  Top 0.305: 30.23,19.49 31.27,19.49
  Top 0.406: MCU.10 24.16,14.63 29.02,19.49 30.23,19.49 | 31.27,19.49 31.88,19.49 U$4.4
N$1
  Top 0.406: U2.3 74.28,18.94 R20.1 72.58,19.24 71.75,18.41 R17.2
N$2
  Top 0.406: R21.2 75.25,22.42 C12.2
N$3
  Top 0.406: IC1.5 90.11,14.55 R1.1
N$4  (via drill 0.6)
  Top 0.406: R3.2 v10.92,28.24 R2.2 | v87.31,8.89 88.8,10.38 IC1.1
  Bottom 0.406: v10.92,28.24 10.9,28.26 10.16,28.26 9.53,27.62 9.53,26.04 8.26,24.77 6.03,24.77 4.45,23.18 4.45,18.41 9.84,13.02 35.24,13.02 39.37,8.89 v87.31,8.89
N$5
  Top 0.406: JP1.1 62.99,57.15 R5.1 66.5,56.64 Q4.2
N$6
  Top 0.406: Q4.1 R4.2
N$7
  Top 0.406: 20.81,5.63 FB1.2 C5.2 20.57,4.76 16.83,4.76 16.71,4.88 MCU.44
N$8  (via drill 0.38)
  Top 0.406: v83.82,9.84 82.56,9.84 U3.3 | U2.5 73.65,14.28 73.34,13.97 v72.71,13.97
  Bottom 0.406: v72.71,13.97 79.69,13.97 v83.82,9.84
N$9
  Top 0.406: MCU.42 15.11,4.26 15.56,3.81 C1.1
N$10
  Top 0.406: MCU.33 5.95,7.43 R24.2
N$12
  Top 0.406: MCU.6 21.22,11.43 C3.2
N$13
  Top 0.508: X1.1 89.08,40.06 C4.1
  Top 0.61: PTC2.2 98.42,23.05 98.42,33.97 97.16,35.24 87.31,35.24 87,35.56 87,39.05 87.69,39.75 C4.1
N$14
  Top 0.406: U$13.CATHODE1 6.03,28.26 8.26,28.26 9.4,27.11 R2.1
N$15
  Top 0.406: U$17.ANODE1 6.03,33.34 8.26,33.34 9.4,32.19 R16.2
N$17
  Top 0.406: U$11.ANODE1 6.03,43.5 8.26,43.5 9.31,42.44 R12.2
N$19
  Top 0.406: U$11.ANODE2 R13.2
N$21
  Top 0.406: U$17.ANODE2 R15.2
N$25
  Top 0.406: U$14.ANODE1 6.03,38.42 8.26,38.42 9.4,37.27 R14.2
N$27
  Top 0.406: U2.2 74.94,18.94 R21.1 C21.2
N$29
  Top 0.406: U2.7 74.94,13.45 R23.1 C22.2
N$32
  Top 0.406: U$14.ANODE2 R7.2
PT-IN  (via drill 0.38)
  Top 0.406: MCU.1 18.51,6.58 v18.73,6.35
  Bottom 0.406: v18.73,6.35 6.03,6.35 5.4,5.71 2.54,5.71 0.95,7.3 0.95,54.29 6.03,59.37 60.64,59.37 JP1.2
REMOTE-LASER  (via drill 0.38)
  Top 0.406: MCU.19 11.11,15.87 v10.79,15.56 | v50.16,19.37 v66.99,19.37
  Bottom 0.406: v10.79,15.56 10.79,15.24 11.43,14.61 17.14,14.61 24.77,22.23 34.61,22.23 37.47,19.37 v50.16,19.37 | v66.99,19.37 82.23,19.37 U$7.P$3
RLB  (via drill 0.38)
  Top 0.406: MCU.8 43.19,13.03 v45.4,15.24 | v54.29,15.24 v56.52,15.24
  Bottom 0.406: v45.4,15.24 v54.29,15.24 | v56.52,15.24 57.15,15.24 64.14,22.23 74.93,22.23 U$7.P$7
RSSI
  Top 0.406: R13.1 11.01,66.25 13.65,68.9 80.96,68.9 81.77,69.7 XB1.6
RST  (via drill 0.38)
  Top 0.406: 19.37,18.92 17.65,18.92 v17.46,18.73 16.51,18.73 15.91,18.13 MCU.13 | 19.37,18.92 R18.1 v21.27,17.46 | D2.A 19.37,18.92 | v17.46,23.81 19.07,23.81 S2.2 | U$4.5 29.21,17.09 v29.21,17.14
  Bottom 0.406: v17.46,18.73 v17.46,23.81 | v29.21,17.14 28.89,17.46 v21.27,17.46
RX2  (via drill 0.38)
  Top 0.406: MCU.20 10.31,18.9 9.53,19.68 6.99,19.68 v6.67,20 | v64.77,51.44 65.09,51.12 77.15,51.12 78.11,50.16 86.68,50.16 89.77,53.26 XB1.2
  Bottom 0.406: v6.67,20 6.67,22.54 6.99,22.86 12.06,22.86 17.78,28.57 24.45,28.57 27.3,31.43 27.3,43.5 35.56,51.75 64.45,51.75 v64.77,51.44
SCK
  Top 0.406: MCU.9 24.62,13.83 29.02,18.22 U$4.3
TX2  (via drill 0.38)
  Top 0.406: MCU.21 9.51,18.43 9.21,18.73 v6.67,18.73 | v66.36,52.7 67.31,52.7 67.94,52.07 69.22,52.07 70.17,53.02 R10.2
  Bottom 0.406: v66.36,52.7 35.24,52.7 26.35,43.81 26.35,31.75 24.13,29.53 17.46,29.53 11.75,23.81 6.35,23.81 5.4,22.86 5.4,19.05 5.71,18.73 v6.67,18.73
TX2L
  Top 0.406: R10.1 R11.2 85.41,53.15 85.41,53.66 85.72,53.98 87,53.98 87.77,54.75 XB1.3
VBAT
  Top 0.406: R23.2 74.28,13.45 U2.6 74.28,15.86 74.61,16.19 75.25,16.19 75.58,16.52 U2.1 75.63,17.46 76.83,17.46 79.58,20.21 L1.P$2
  Top 0.61: S1.1 93.66,32.7 93.98,32.38 93.98,23.81 93.03,22.86 88.2,22.86 C24.2 81.11,20.07 L1.P$2
XTAL1
  Top 0.406: MCU.17 12.71,20.95 12.32,21.34 Q1.2
  Bottom 0.406: Q1.2 11.18,21.34 C6.2
XTAL2
  Top 0.406: MCU.16 13.51,21.13 13.72,21.34 Q1.1
  Bottom 0.406: Q1.1 14.22,21.34 C7.2

### Text on the board
tSilk: Laptimer Main unit / Version 1